# EAGLE design mikromedia shield (EAGLE 6.5.0)
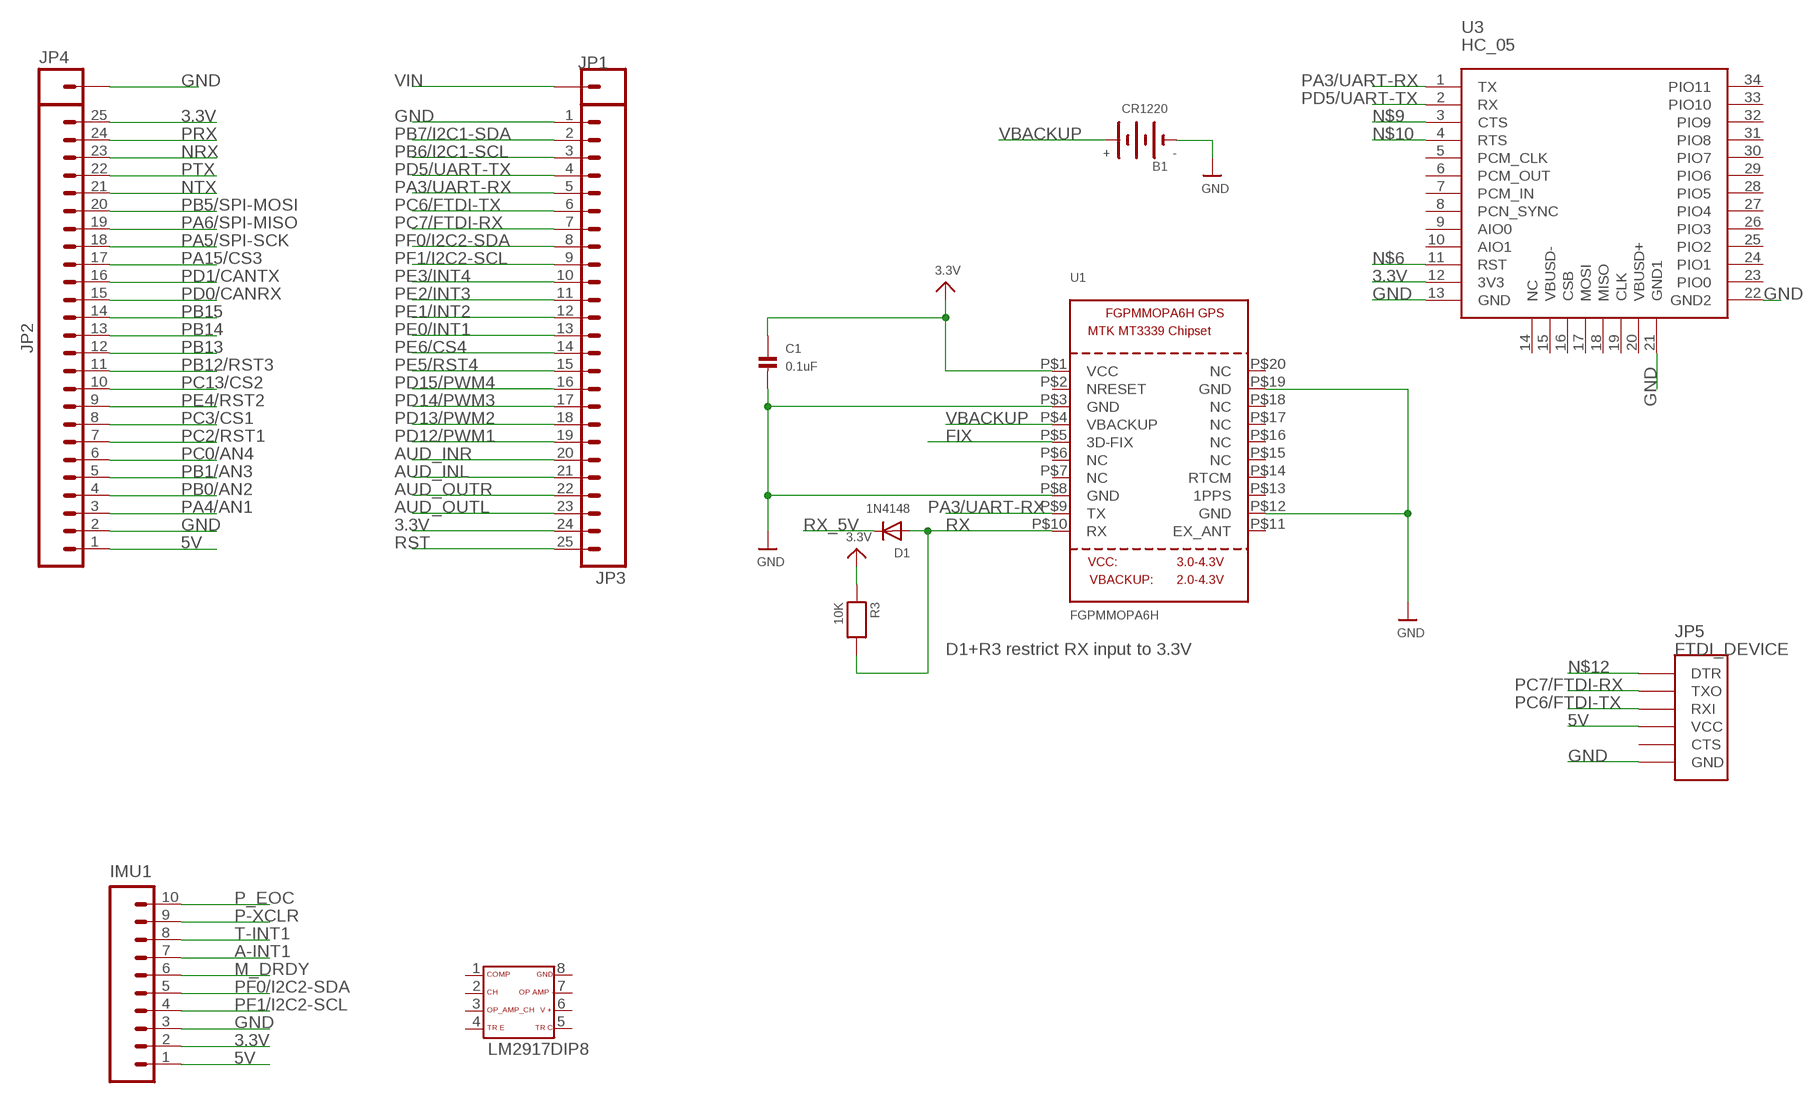
[diagram p0: schematic, sheet 1]

## Parts
B1  CR1220  BATTERYCR1220_SMT  [CR1220]
C1  0.1uF  CAP_CERAMIC0805  [0805]
D1  1N4148  DIODESOD-323F  [SOD-323F]
IC1  LM2917DIP8  [LM2917_DIP8]
IMU1  IMU  M10LOCK_LONGPADS  [1X10_LOCK_LONGPADS]
JP1  M01PTH  [1X01]
JP2  M25LOCK_LONGPADS  [1X25_LOCK_LONGPADS]
JP3  M25LOCK_LONGPADS  [1X25_LOCK_LONGPADS]
JP4  M01PTH  [1X01]
JP5  FTDI_DEVICE  [FTDI_DEVICE_SIDE]
R3  10K  RESISTOR0805  [0805]
U1  FGPMMOPA6H  GPS_FGPMMOPA6H  [FGPMMOPA6H]
U3  HC_05  [BLUETOOTH_SMD]

## Nets
3.3V: C1.1 IMU1.2 JP2.25 JP3.24 R3.1 U1.P$1(VCC) U3.12(3V3)
5V: IMU1.1 JP2.1 JP5.P$4(VCC)
A-INT1: IMU1.7
AUD_INL: JP3.21
AUD_INR: JP3.20
AUD_OUTL: JP3.23
AUD_OUTR: JP3.22
FIX: U1.P$5(3D-FIX)
GND: B1.- C1.2 IMU1.3 JP2.2 JP3.1 JP4.1 JP5.P$6(GND) U1.P$3(GND) U1.P$8(GND) U1.P$12(GND) U1.P$19(GND) U3.13(GND) U3.21(GND1) U3.22(GND2)
M_DRDY: IMU1.6
N$6: U3.11(RST)
N$9: U3.3(CTS)
N$10: U3.4(RTS)
N$12: JP5.P$1(DTR)
NRX: JP2.23
NTX: JP2.21
P-XCLR: IMU1.9
P_EOC: IMU1.10
PA3/UART-RX: JP3.5 U1.P$9(TX) U3.1(TX)
PA4/AN1: JP2.3
PA5/SPI-SCK: JP2.18
PA6/SPI-MISO: JP2.19
PA15/CS3: JP2.17
PB0/AN2: JP2.4
PB1/AN3: JP2.5
PB5/SPI-MOSI: JP2.20
PB6/I2C1-SCL: JP3.3
PB7/I2C1-SDA: JP3.2
PB12/RST3: JP2.11
PB13: JP2.12
PB14: JP2.13
PB15: JP2.14
PC0/AN4: JP2.6
PC2/RST1: JP2.7
PC3/CS1: JP2.8
PC6/FTDI-TX: JP3.6 JP5.P$3(RXI)
PC7/FTDI-RX: JP3.7 JP5.P$2(TXO)
PC13/CS2: JP2.10
PD0/CANRX: JP2.15
PD1/CANTX: JP2.16
PD5/UART-TX: JP3.4 U3.2(RX)
PD12/PWM1: JP3.19
PD13/PWM2: JP3.18
PD14/PWM3: JP3.17
PD15/PWM4: JP3.16
PE0/INT1: JP3.13
PE1/INT2: JP3.12
PE2/INT3: JP3.11
PE3/INT4: JP3.10
PE4/RST2: JP2.9
PE5/RST4: JP3.15
PE6/CS4: JP3.14
PF0/I2C2-SDA: IMU1.5 JP3.8
PF1/I2C2-SCL: IMU1.4 JP3.9
PRX: JP2.24
PTX: JP2.22
RST: JP3.25
RX: D1.A R3.2 U1.P$10(RX)
RX_5V: D1.C
T-INT1: IMU1.8
VBACKUP: B1.+$1(+) U1.P$4(VBACKUP)
VIN: JP1.1
Unconnected: IC1.1 IC1.2 IC1.3 IC1.4 IC1.5 IC1.6 IC1.7 IC1.8 JP5.P$5(CTS) U1.P$2(NRESET) U1.P$6(NC) U1.P$7(NC) U1.P$11(EX_ANT) U1.P$13(1PPS) U1.P$14(RTCM) U1.P$15(NC) U1.P$16(NC) U1.P$17(NC) U1.P$18(NC) U1.P$20(NC) U3.5(PCM_CLK) U3.6(PCM_OUT) U3.7(PCM_IN) U3.8(PCN_SYNC) U3.9(AIO0) U3.10(AIO1) U3.14(NC) U3.15(VBUSD-) U3.16(CSB) U3.17(MOSI) U3.18(MISO) U3.19(CLK) U3.20(VBUSD+) U3.23(PIO0) U3.24(PIO1) U3.25(PIO2) U3.26(PIO3) U3.27(PIO4) U3.28(PIO5) U3.29(PIO6) U3.30(PIO7) U3.31(PIO8) U3.32(PIO9) U3.33(PIO10) U3.34(PIO11)

## Notes on the sheet
- D1+R3 restrict RX input to 3.3V

## Library data of the parts
B1 = microbuilder:BATTERY
C1 = microbuilder:CAP_CERAMIC: Ceramic Capacitors 0402 - 0402 Surface Mount Capacitors 16pF 50V 5% [Digikey: 445-4899-2-ND] 18pF 50V 5% [Digikey: 490-1281-2-ND] 22pF 50V 5% [Digikey: 490-1283-2-ND] 68pF 50V 5% [Digikey: 490-1289-2-ND] 0.1uF 10V 10% [Digikey: 490-1318-2-ND] 1.0uF 6.3V 10% [Digikey: 490-1320-2-ND] 0603 - 0603 Surface Mount Capacitors 16 pF 50V 5% [Digikey: 445-5051-2-ND] 22 pF 50V [Digikey: PCC220ACVTR-ND] 33 pF 50V 5% [Digikey: 490-1415-1-ND] 56pF 50V 5% [Digikey: 490-1421-1-ND] 220pF 50V 5% [Digikey: 445-1285-1-ND] 680 pF 50V 2200 pF 50V 5% C0G [Digikey: 445-1297-1-ND] 5600 pF 100V 5% X7R [Digikey: 478-3711-1-ND] 0.1 µF 25V 10% [Digikey: PCC2277TR-ND] 0.22 µF 16V 10% X7R [Digikey: 445-1318-1-ND] 1.0 µF 25V 10% [Digikey: 445-5146-2-ND] 0603 - RF Specific 3pF 250V +/-0.1pF RF [Digikey: 712-1347-1-ND] 18 pF 250V 5% [Digikey: 478-3505-1-ND or 712-1322-1-ND] 56 pF 250V 5% C0G RF [Digikey: 490-4867-1-ND] 68 pF 250V RF [Digikey: 490-4868-1-ND] 0805 - 0805 Surface Mount Capacitors 220 pF 250V 2% RF Ceramic Capacitor [Digikey: 712-1398-1-ND] 1000 pF 50V 2% NP0 Ceramic Capacitor [Digikey: 478-3760-1-ND] 0.1 µF 25V 10% Ceramic Capacitor [Digikey: PCC1828TR-ND] 1.0 µF 16V 10% Ceramic Capacitor[Digikey: 490-1691-2-ND] 10.0 µF 10V 10% Ceramic Capacitor[Digikey: 709-1228-1-ND] 10.0 uF 16V 10% Ceramic Capacitor [Digikey: 478-5165-2-ND] 47 uF 6.3V 20% Ceramic Capacitor [Digikey: 587-1779-1-ND or 399-5506-1-ND] 1206 - 1206 Surface Mount Capacitors 47uF 10V 20% Ceramic Capacitor [Digikey: 490-5528-1-ND or 399-5508-1-ND or 445-6010-1-ND] 100uF 6.3V -20%, +80% Y5V Ceramic Capacitor (Digikey: 490-4512-1-ND, Mouser: 81-GRM31CF50J107ZE1L)
D1 = adafruit:DIODE: Diode SMADIODE - SMA Surface Mount Package 20V 1A Schottky Diode Digikey: 641-1014-6-ND DO-1N4148 - Through Hole Small Current Diode SOD-123 20V 1 A (.5mV Vf) Schottky Diode - Digikey: MBRX120TPMSCT-ND SOD-323 10V 570mA (.38mV Vf, 3ns) Schottky Diode - Digikey: ZLLS410CT-ND SOD-523 30V 30mA Schottky Diode (RB751S-40TE61) - Digikey: RB751S-40TE61CT-ND SOT23-R/W - SOT23 Package (R = Solder Paste/Reflow Ovens, W = Hand-Soldering) BAT54Film 40V 300mA - Digikey: 497-7162-1-ND
IC1 = LM2917_SO8_DIP8:LM2917: LM2907 LM2917 Frequency to Voltage Converter General Description The LM2907, LM2917 series are monolithic frequency to volt- age converters with a high gain op amp/comparator designed o operate a relay, lamp, or other load when the input fre- quency reaches or exceeds a selected rate. The tachometer uses a charge pump technique and offers frequency doubling or low ripple, full input protection in two versions (LM2907-8, LM2917-8) and its output swings to ground for a zero fre- quency input. The op amp/comparator is fully compatible with the tachome- er and has a floating transistor as its output. This feature allows either a ground or supply referred load of up to 50 mA. The collector may be taken above VCC up to a maximum VCE of 28V. The two basic configurations offered include an 8-pin device with a ground referenced tachometer input and an internal connection between the tachometer output and the op amp non-inverting input. This version is well suited for single speed or frequency switching or fully buffered frequency to voltage conversion applications. The more versatile configurations provide differential achometer input and uncommitted op amp inputs. With this version the tachometer input may be floated and the op amp becomes suitable for active filter conditioning of the tachome- er output. Both of these configurations are available with an active shunt regulator connected across the power leads. The regulator clamps the supply such that stable frequency to voltage and requency to current operations are possible with any supply voltage and a suitable resistor.
IMU1 = SparkFun-Connectors:M10: Header 10 Standard 10-pin 0.1" header. Use with straight break away headers (SKU : PRT-00116), right angle break away headers (PRT-00553), swiss pins (PRT-00743), machine pins (PRT-00117), and female headers (PRT-00115).
JP1 JP4 = SparkFun-Connectors:M01: Header 1 Standard 1-pin 0.1" header. Use with straight break away headers (SKU : PRT-00116), right angle break away headers (PRT-00553), swiss pins (PRT-00743), machine pins (PRT-00117), and female headers (PRT-00115).
JP2 JP3 = SparkFun-Connectors:M25: 1x25 .1" header
JP5 = SparkFun-Connectors:FTDI_DEVICE: Connector which mates to FTDI basic or FTDI cable.
R3 = microbuilder:RESISTOR: Resistors 0402 - 0402 Surface Mount Package 22 Ohm 1% 1/16W [Digikey: 311-22.0LRTR-ND] 33 Ohm 5% 1/16W 1.0K 5% 1/16W 1.5K 5% 1/16W 2.0K 1% 1/16W 10.0K 1% 1/16W [Digikey: 311-10.0KLRTR-ND] 10.0K 5% 1/16W [Digikey: RMCF0402JT10K0TR-ND] 12.1K 1% 1/16W [Digikey: 311-22.0LRTR-ND] 100.0K 5% 1/16W 0603 - 0603 Surface Mount Package 0 Ohm 1/10 Watt 1% Resistor 15 Ohm 1/10 Watt 1% Resistor 33 Ohm 1/10 Watt 1% Resistor 49.9 Ohm 1/10 Watt 1% Resistor 100 Ohm 1/10 Watt 1% Resistor 150 Ohm 1/10 Watt 1% Resistor 240 Ohm 1/10 Watt 1% Resistor 390 Ohm 1/10 Watt 1% Resistor 560 Ohm 1/10 Watt 1% Resistor 680 Ohm 1/10 Watt 1% Resistor 750 Ohm 1/10 Watt 1% Resistor 1.0K Ohm 1/10 Watt 1% Resistor 1.5K Ohm 1/10 Watt 1% Resistor 2.0K Ohm 1/10 Watt 1% Resistor 2.2K Ohm 1/10 Watt 1% Resistor 3.3K Ohm 1/10 Watt 1% Resistor 4.7K Ohm 1/10 Watt 1% Resistor 10.0K Ohm 1/10 Watt 1% Resistor 12.0K Ohm 1/10 Watt 1% Resistor 12.1K Ohm 1/10 Watt 1% Resistor 20.0K Ohm 1/10 Watt 1% Resistor 33.0K Ohm 1/10 Watt 1% Resistor 100.0K Ohm 1/10 Watt 1% Resistor 0805 - 0805 Surface Mount Package 0 Ohm 1/8 Watt 1% Resistor 33 Ohm 1/8 Watt 1% Resistor 100 Ohm 1/8 Watt 1% Resistor 150 Ohm 1/8 Watt 1% Resistor 200 Ohm 1/8 Watt 1% Resistor 240 Ohm 1/8 Watt 1% Resistor 330 Ohm 1/8 Watt 1% Resistor 390 Ohm 1/8 Watt 1% Resistor 470 Ohm 1/8 Watt 1% Resistor 1.0K Ohm 1/8 Watt 1% Resistor 1.5K Ohm 1/8 Watt 1% Resistor 2.0K Ohm 1/8 Watt 1% Resistor 4.7K Ohm 1/8 Watt 1% Resistor 5.1K Ohm 1/8 Watt 1% Resistor 5.6K Ohm 1/8 Watt 1% Resistor 10.0K Ohm 1/8 Watt 1% Resistor 22.0K Ohm 1/8 Watt 1% Resistor 33.0K Ohm 1/8 Watt 1% Resistor 100K Ohm 1/8 Watt 1% Resistor 1206 - 1206 Surface Mount Package 2012 - 2010 Surface Mount Package 0.11 Ohm 1/2 Watt 1% Resistor - Digikey: RHM.11UCT-ND
U1 = microbuilder:GPS_FGPMMOPA6H: GPS Module - MTK MT3339 Chipset, -165dBm sensitivity, 22 channels, 10Hz, auto-select external antenna options
U3 = SerialPortBluetooth:HC_05

## Board
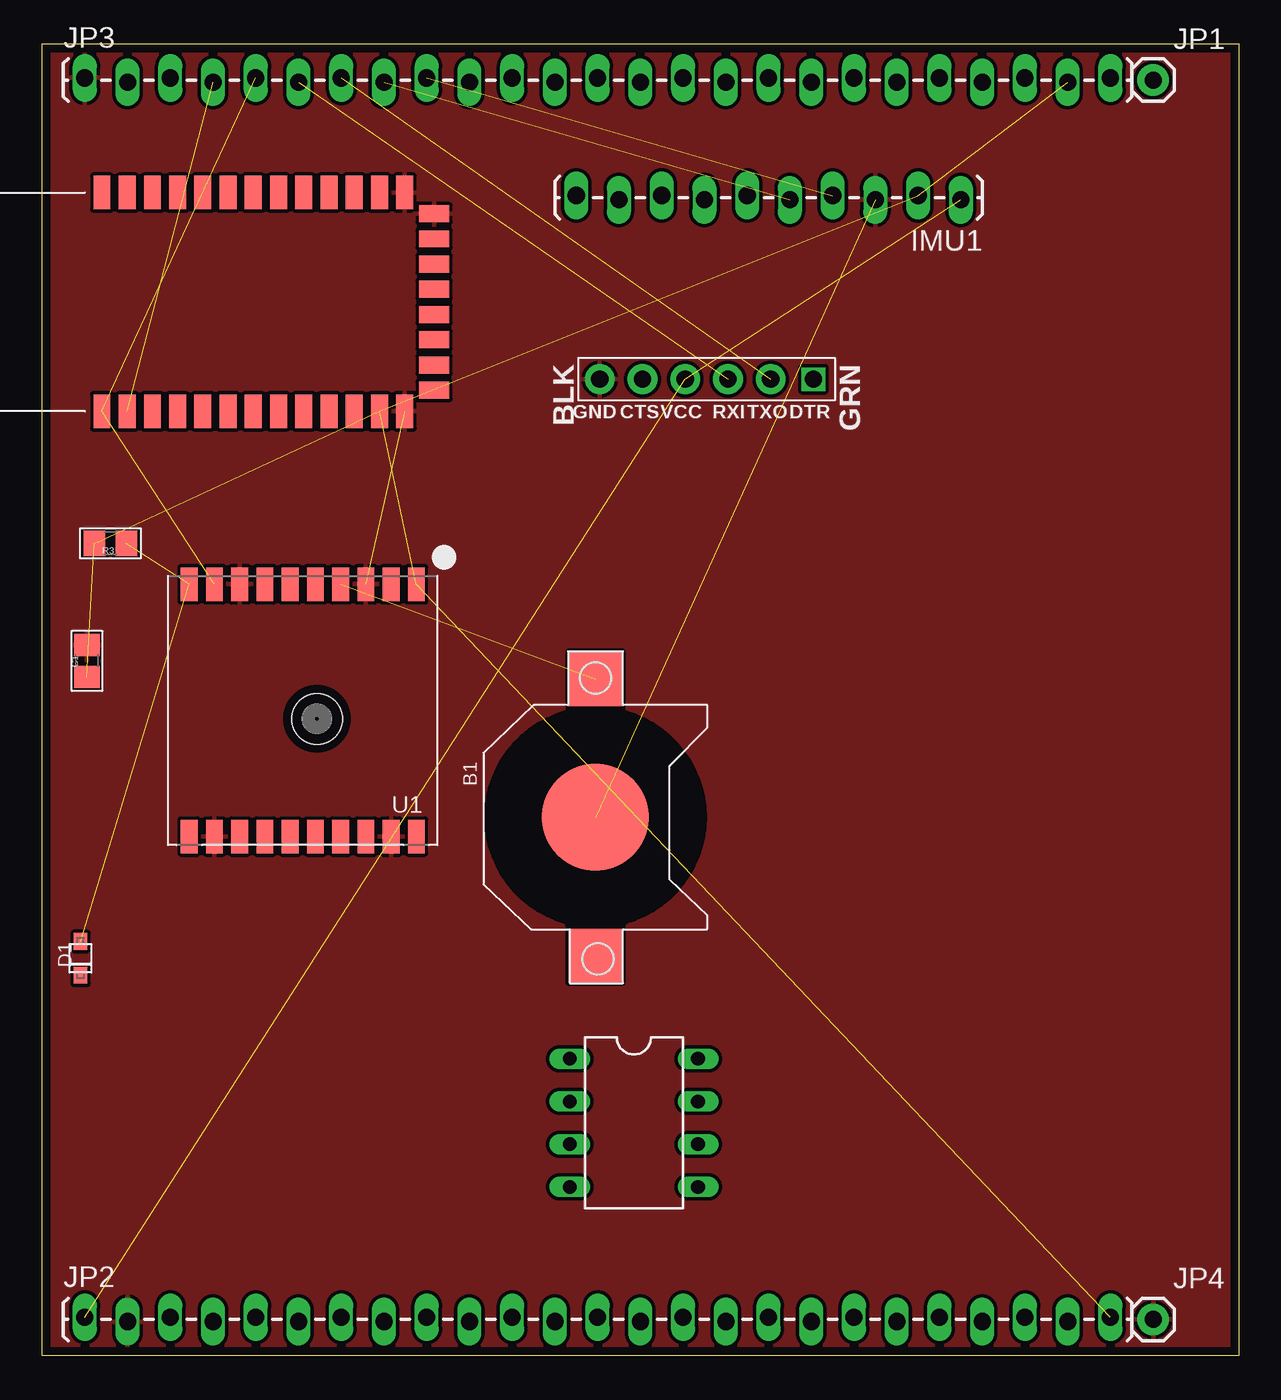
[diagram p1: board, top side]
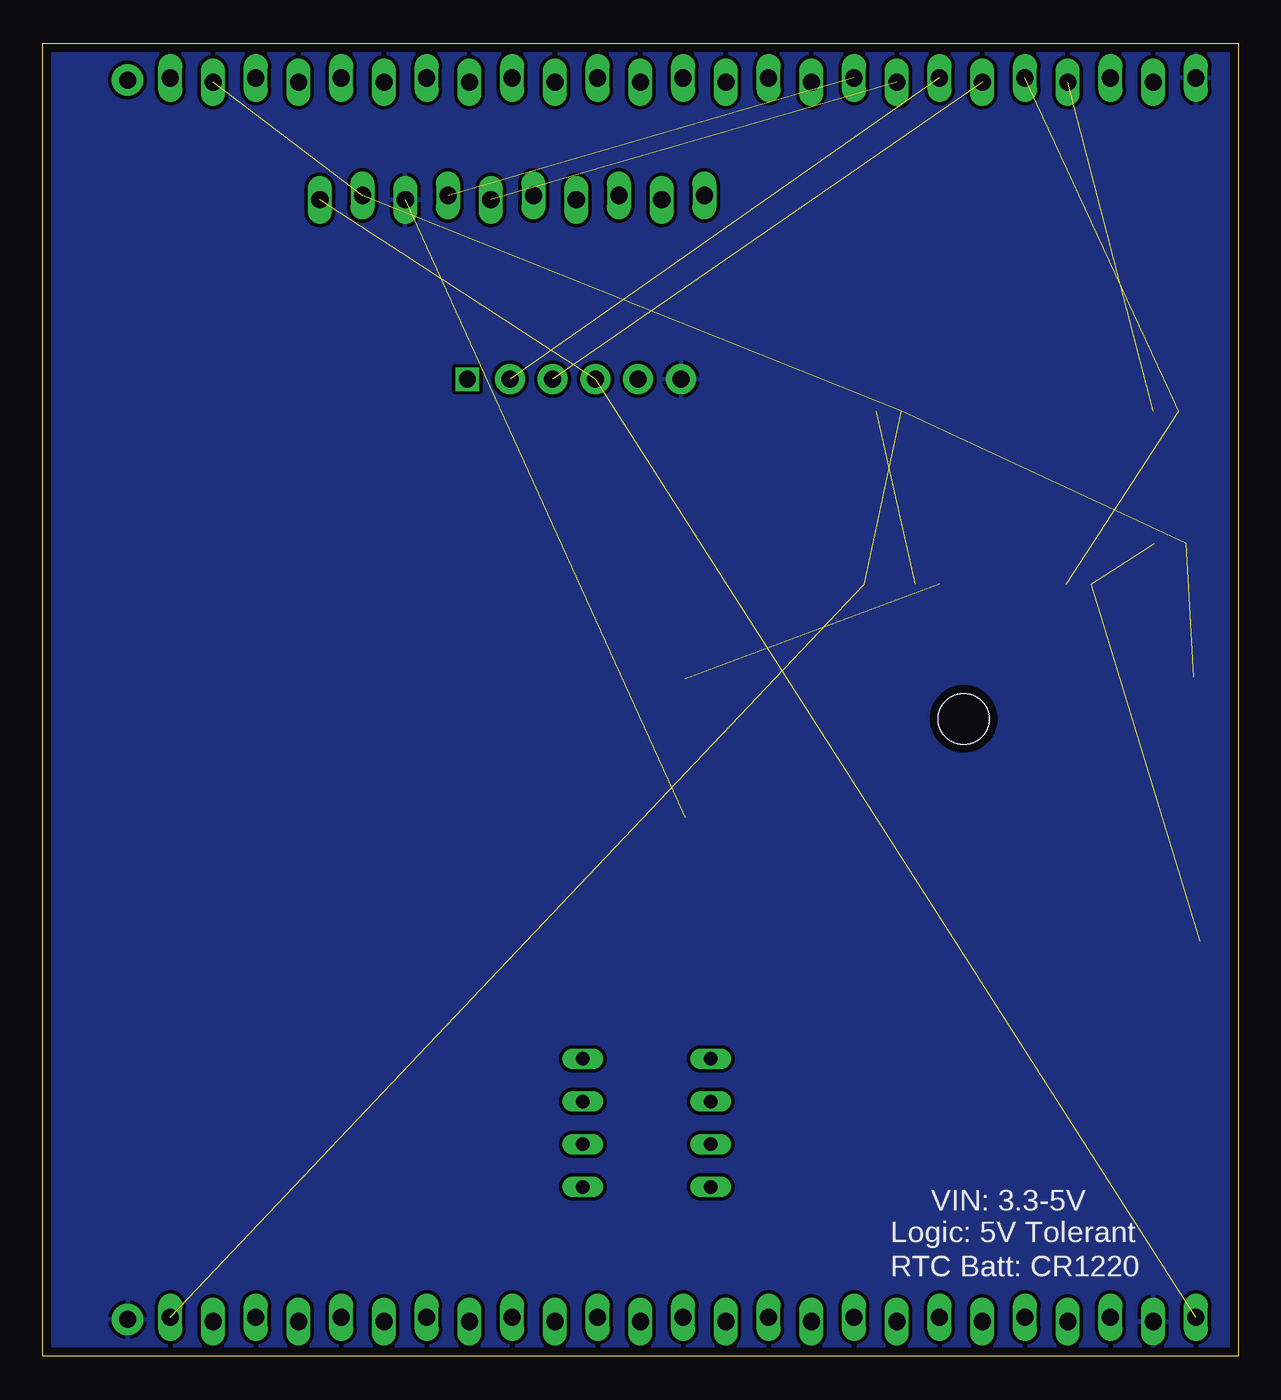
[diagram p2: board, bottom side, seen from below]

Size 71.12 x 77.98 mm. Coordinates in mm from the lower left corner, seen from the top.
Outline: 0,0 0,77.98 71.12,77.98 71.12,0 0,0
Copper layers (1*16): Top 0.035mm / dielectric 1.5mm / Bottom 0.035mm
Design rules "default": minimum track width 8mil, minimum drill 0.4mm, track to track 8mil, track to pad 8mil, pad to pad 8mil, via to via 8mil, smd to smd 8mil, copper to edge 20mil, drill to drill 8mil, minimum pad ring 8mil, minimum via ring 10mil, stop-mask expansion 3mil, vias tented up to drill 20mil, thermal gap 8mil

### Footprints (pad centres in the part's own frame; a part is rotated, then mirrored left to right if it is on the bottom)
CR1220 = smd 3.2 x 3.2: +$1 -8.225,0; +$2 8.225,0 | smd 6.35 x 6.35: - 0,0
0805 = smd 1.3 x 1.5: 1 -0.95,0; 2 0.95,0
SOD-323F = smd 1 x 0.8: A -1,0; C 1,0
LM2917_DIP8 = drill 0.813 long: 1 -3.81,-3.81; 2 -1.27,-3.81; 3 1.27,-3.81; 4 3.81,-3.81; 5 3.81,3.81; 6 1.27,3.81; 7 -1.27,3.81; 8 -3.81,3.81
1X10_LOCK_LONGPADS = drill 1.016 long: 1 0,0.127; 2 2.54,-0.127; 3 5.08,0.127; 4 7.62,-0.127; 5 10.16,0.127; 6 12.7,-0.127; 7 15.24,0.127; 8 17.78,-0.127; 9 20.32,0.127; 10 22.86,-0.127
1X01 = drill 1.016 pad 1.88: 1 0,0
1X25_LOCK_LONGPADS = drill 1.016 long: 1 0,0.127; 2 2.54,-0.127; 3 5.08,0.127; 4 7.62,-0.127; 5 10.16,0.127; 6 12.7,-0.127; 7 15.24,0.127; 8 17.78,-0.127; 9 20.32,0.127; 10 22.86,-0.127; 11 25.4,0.127; 12 27.94,-0.127; 13 30.48,0.127; 14 33.02,-0.127; 15 35.56,0.127; 16 38.1,-0.127; 17 40.64,0.127; 18 43.18,-0.127; 19 45.72,0.127; 20 48.26,-0.127; 21 50.8,0.127; 22 53.34,-0.127; 23 55.88,0.127; 24 58.42,-0.127; 25 60.96,0.127
FTDI_DEVICE_SIDE = drill 1 square: P$1 -6.35,0 | drill 1.016 pad 1.778: P$2 -3.81,0; P$3 -1.27,0; P$4 1.27,0; P$5 3.81,0; P$6 6.35,0
FGPMMOPA6H = smd 2 x 1: P$1 -7.5,6.75; P$2 -7.5,5.25; P$3 -7.5,3.75; P$4 -7.5,2.25; P$5 -7.5,0.75; P$6 -7.5,-0.75; P$7 -7.5,-2.25; P$8 -7.5,-3.75; P$9 -7.5,-5.25; P$10 -7.5,-6.75; P$11 7.5,-6.75; P$12 7.5,-5.25; P$13 7.5,-3.75; P$14 7.5,-2.25; P$15 7.5,-0.75; P$16 7.5,0.75; P$17 7.5,2.25; P$18 7.5,3.75; P$19 7.5,5.25; P$20 7.5,6.75 | hole 3: 0.5,0.85
BLUETOOTH_SMD = smd 2 x 1: 1 0,0; 2 0,-1.5; 3 0,-3; 4 0,-4.5; 5 0,-6; 6 0,-7.5; 7 0,-9; 8 0,-10.5; 9 0,-12; 10 0,-13.5; 11 0,-15; 12 0,-16.5; 13 0,-18; 22 13,-18; 23 13,-16.5; 24 13,-15; 25 13,-13.5; 26 13,-12; 27 13,-10.5; 28 13,-9; 29 13,-7.5; 30 13,-6; 31 13,-4.5; 32 13,-3; 33 13,-1.5; 34 13,0 | smd 1 x 1.8: 14 1.25,-19.75; 15 2.75,-19.75; 16 4.25,-19.75; 17 5.75,-19.75; 18 7.25,-19.75; 19 8.75,-19.75; 20 10.25,-19.75; 21 11.75,-19.75

### Placement (x,y rotation side)
B1  32.89,32 270 top
C1  2.67,41.3 90 top
D1  2.29,23.62 270 top
IC1  35.18,13.84 270 top
IMU1  54.61,68.83 180 top
JP1  66.04,75.82 0 top
JP2  2.54,2.16 0 top
JP3  2.54,75.82 0 top
JP4  66.04,2.16 0 top
JP5  39.5,58.04 180 top
R3  4.06,48.28 0 top
U1  15.49,38.35 270 top
U3  3.56,56.13 90 top

### Tracks (layer width: path | path; a pad name or v marks a point on that pad's centre or on a via)
3.3V  (6 unrouted)
5V  (2 unrouted)
GND  (2 unrouted)
  pour Bottom (isolate 0.203): 0,0 0,77.98 71.12,77.98 71.12,0
  pour Bottom (isolate 0.203): 0,0 0,77.98 71.12,77.98 71.12,0
  pour Top (isolate 0.203): 0,0 0,77.98 71.12,77.98 71.12,0
PA3/UART-RX  (2 unrouted)
PC6/FTDI-TX  (1 unrouted)
PC7/FTDI-RX  (1 unrouted)
PD5/UART-TX  (1 unrouted)
PF0/I2C2-SDA  (1 unrouted)
PF1/I2C2-SCL  (1 unrouted)
RX  (2 unrouted)
VBACKUP  (1 unrouted)

### Text on the board
bPlace: VIN: 3.3-5V | Logic: 5V Tolerant | RTC Batt: CR1220